# EAGLE design Grove - Temperature, Humidity, Pressure and Gas Sensor (BME680) (EAGLE 6.4)
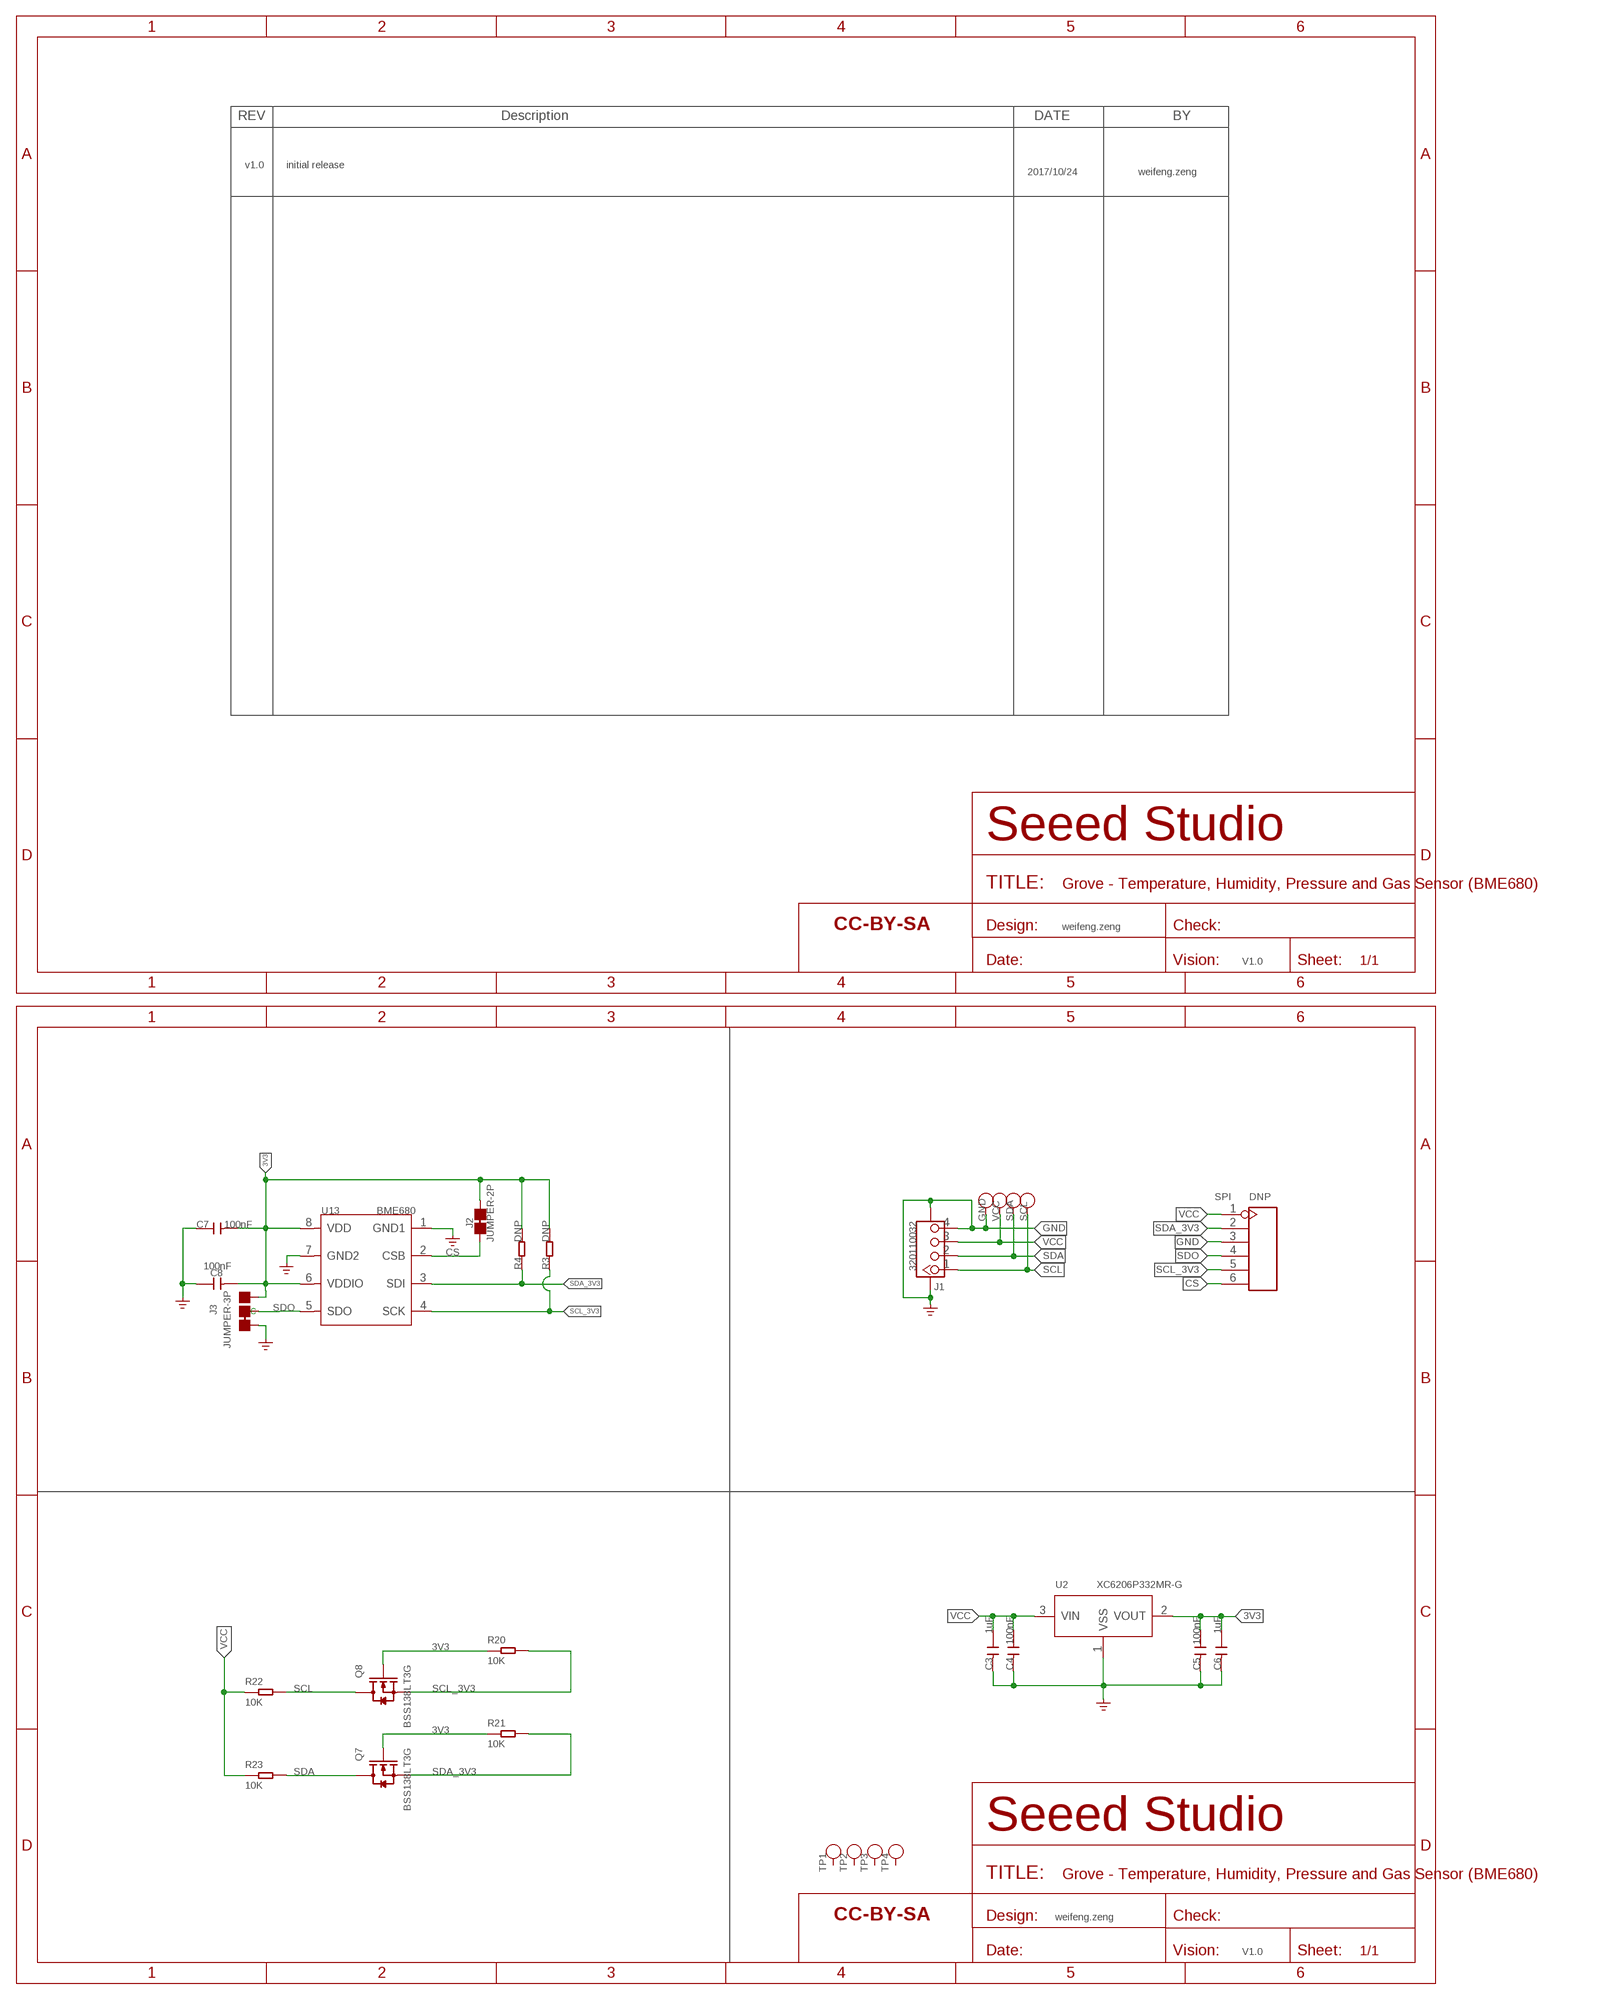
[diagram p0: schematic, sheet 1]

## Parts
C3  1uF  CAP-0603  [C0603]
C4  100nF  CAP-0603  [C0603]
C5  100nF  CAP-0603  [C0603]
C6  1uF  CAP-0603  [C0603]
C7  100nF  CAP-0603  [C0603]
C8  100nF  CAP-0603  [C0603]
FR1  SEEEDSTUDIO-OPEN-SCH-FRAME  [SEEEDSTUDIO-PCB-FRAME]
FR2  SEEEDSTUDIO-OPEN-SCH-FRAME  [SEEEDSTUDIO-PCB-FRAME]
GND  TEST-POINT'4545'  [TP-D45MIL]
J1  320110032  GROVE-CONNECTOR-SMD'90D'  [HW4-SMD-2.0-90D]
J2  JUMPER-2P  JUMPER-2P-SHORT  [2P-SMD-SHORT]
J3  JUMPER-3P  JUMPER-3P-SHORT  [3P-SMD-SHORT]
Q7  BSS138LT3G  MOSFET-N'SOT23'  [SOT-23]
Q8  BSS138LT3G  MOSFET-N'SOT23'  [SOT-23]
R3  DNP  RES-0603  [R0603]
R4  DNP  RES-0603  [R0603]
R20  10K  RES-0603  [R0603]
R21  10K  RES-0603  [R0603]
R22  10K  RES-0603  [R0603]
R23  10K  RES-0603  [R0603]
SCL  TEST-POINT'4545'  [TP-D45MIL]
SDA  TEST-POINT'4545'  [TP-D45MIL]
SPI  DNP  HEADER-6P-65/35MIL  [H6-2.54-C65D35MIL]
TP1  TEST-POINT'4545'  [TP-D45MIL]
TP2  TEST-POINT'4545'  [TP-D45MIL]
TP3  TEST-POINT'4545'  [TP-D45MIL]
TP4  TEST-POINT'4545'  [TP-D45MIL]
U2  XC6206P332MR-G  PMIC-XC6206PMR  [SOT-23]
U13  BME680  SENSOR-BME680  [SNR8-0.8-3X3X0.93MM]
VCC  TEST-POINT'4545'  [TP-D45MIL]

## Nets
3V3: C5.1 C6.1 C7.2 C8.2 J2.2 J3.00(R) Q7.1(G) Q8.1(G) R3.2 R4.2 R20.1 R21.1 U2.2(VOUT) U13.6(VDDIO) U13.8(VDD)
CS: J2.1 SPI.6 U13.2(CSB)
GND: C3.2 C4.2 C5.2 C6.2 C7.1 C8.1 GND.T J1.4 J1.SS1 J1.SS2 J3.11(L) SPI.3 U2.1(VSS) U13.1(GND1) U13.7(GND2) ; supply symbol labelled GND_POWER
SCL: J1.1 Q8.3(D) R22.2 SCL.T
SCL_3V3: Q8.2(S) R3.1 R20.2 SPI.5 U13.4(SCK)
SDA: J1.2 Q7.3(D) R23.2 SDA.T
SDA_3V3: Q7.2(S) R4.1 R21.2 SPI.2 U13.3(SDI)
SDO: J3.MM(C) SPI.4 U13.5(SDO)
VCC: C3.1 C4.1 J1.3 R22.1 R23.1 SPI.1 U2.3(VIN) VCC.T
Unconnected: TP1.T TP2.T TP3.T TP4.T

## Notes on the sheet
- v1.0 | initial release
- 2017/10/24 | weifeng.zeng
- weifeng.zeng
- V1.0
- weifeng.zeng
- V1.0

## Library data of the parts
C3-C8 = Discrete-new:CAP: Ceramic Capacitors
FR1 FR2 = moudle-new:SEEEDSTUDIO-OPEN-SCH-FRAME
GND SCL SDA TP1-TP4 VCC = Discrete-new:TEST-POINT; PARTNO: DNP
J1 = Connector-new:GROVE-CONNECTOR-SMD: 4P-SMD-2.0:320110030;4P-SMD-2.0-90D:320110032
J2 = Discrete-new:JUMPER-2P-SHORT
J3 = Discrete-new:JUMPER-3P-SHORT
Q7 Q8 = Discrete-new:MOSFET-N
R3 R4 R20-R23 = Discrete-new:RES
SPI = Connector-new:HEADER-6P
U2 = IC-new:PMIC-XC6206P: LOW ESR Cap.Compatible Positive Voltage Regulators
U13 = Discrete-new:SENSOR-BME680

## Board
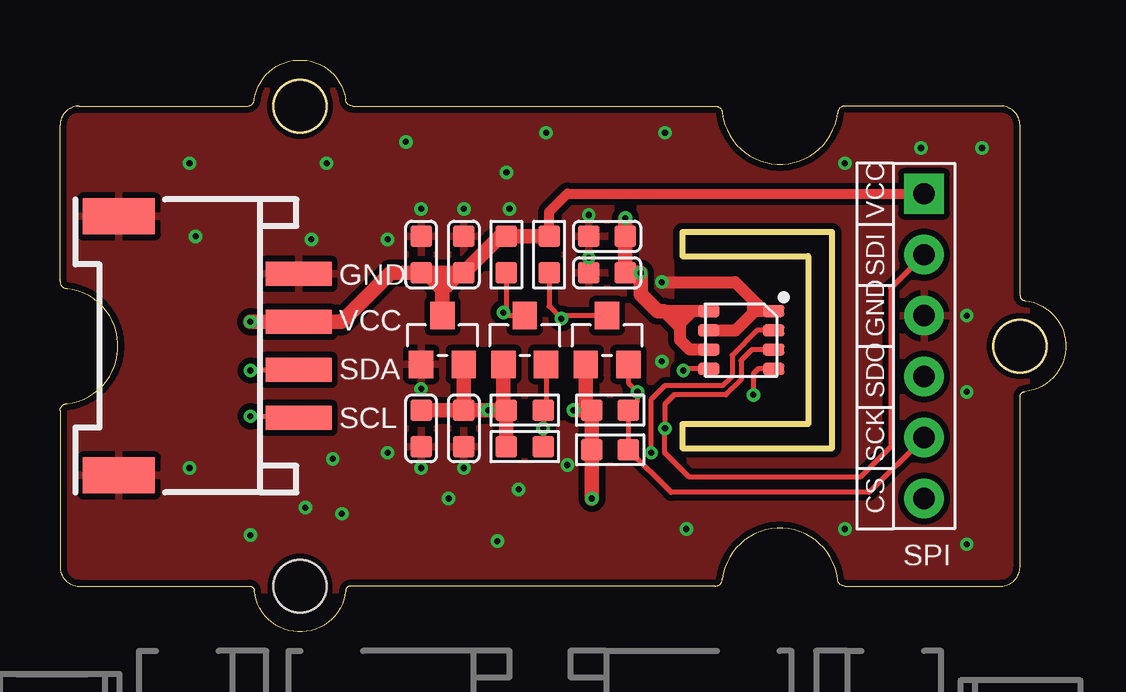
[diagram p1: board, top side]
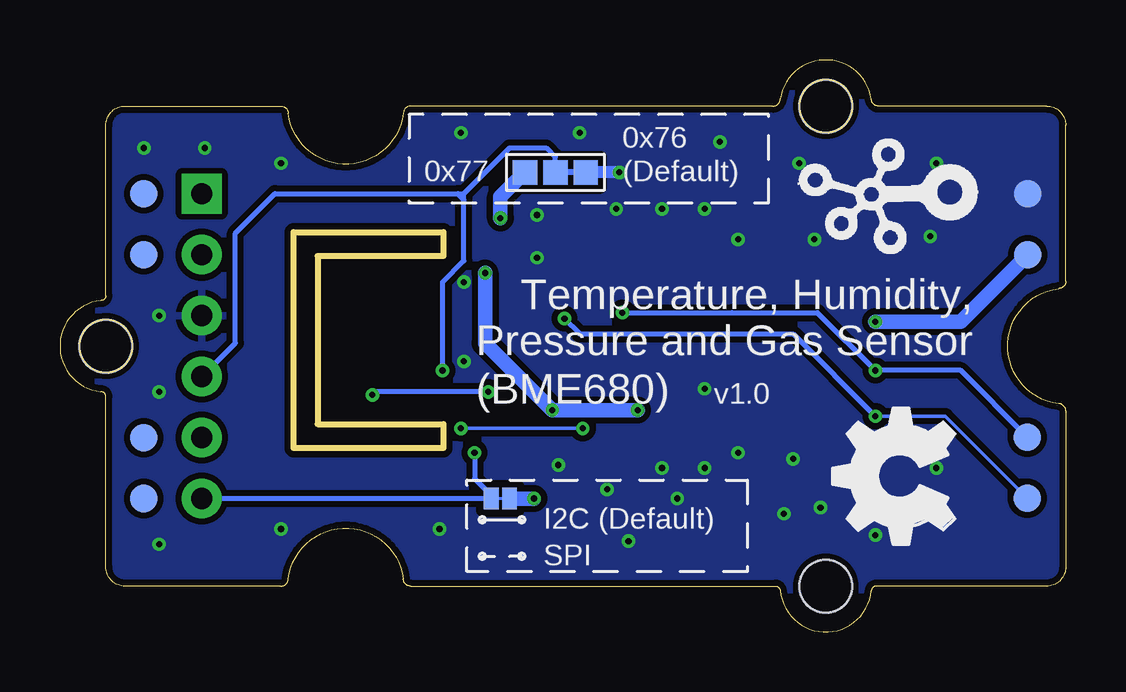
[diagram p2: board, bottom side, seen from below]

Size 41.91 x 23.83 mm. Coordinates in mm from the lower left corner, seen from the top.
Outline: 25.94,15.66 31.17,15.66 31.17,8.66 25.94,8.66 25.94,7.66 32.17,7.66 32.17,16.66 25.94,16.66 25.94,15.66
Copper layers (1*16): Top 0.035mm / dielectric 1.5mm / Bottom 0.035mm
Design rules "SeeedStudio_2layer_DRU_no_angle_20140221 *": minimum track width 6mil, minimum drill 10mil, track to track 6mil, track to pad 6mil, pad to pad 6mil, via to via 6mil, smd to smd 0mil, copper to edge 10mil, drill to drill 10mil, minimum pad ring 10mil, minimum via ring 6mil, stop-mask expansion 2mil, vias tented up to drill 25mil, thermal gap 10mil
tRestrict: area 25.8,7.6 to 32.2,16.7
bRestrict: area 25.8,7.6 to 32.2,16.7

### Footprints (pad centres in the part's own frame; a part is rotated, then mirrored left to right if it is on the bottom)
C0603 = smd 0.889 x 0.889: 1 0,0.762; 2 0,-0.762
TP-D45MIL = smd 1.143 x 1.143: T 0,0
HW4-SMD-2.0-90D = smd 1.01 x 2.74: 1 -3,-0.1; 2 -1,-0.1; 3 1,-0.1; 4 3,-0.1 | smd 1.5 x 3: SS1 -5.4,7.4; SS2 5.4,7.4
2P-SMD-SHORT = smd 0.889 x 0.61: 1 0,0.381; 2 0,-0.381
3P-SMD-SHORT = smd 1.016 x 1.016: 00 -1.27,0; 11 1.27,0; MM 0,0
SOT-23 = smd 1.143 x 1.016: 1 1.016,-0.889; 2 1.016,0.889; 3 -1.016,0
R0603 = smd 0.889 x 0.889: 1 0,0.762; 2 0,-0.762
H6-2.54-C65D35MIL = drill 0.889 pad 1.651 square: 1 0,6.35 | drill 0.889 pad 1.651: 2 0,3.81; 3 0,1.27; 4 0,-1.27; 5 0,-3.81; 6 0,-6.35
SOT-23' = smd 1.016 x 1.143: 1 -0.889,-1.016; 2 0.889,-1.016; 3 0,1.016
GROVE-TEST-PLATFORM = hole 2.2: -10,-10; -10,10; 20,0
SNR8-0.8-3X3X0.93MM = smd 0.9 x 0.5: 1 1.35,1.2; 2 1.35,0.4; 3 1.35,-0.4; 4 1.35,-1.2; 5 -1.35,-1.2; 6 -1.35,-0.4; 7 -1.35,0.4; 8 -1.35,1.2

### Placement (x,y rotation side)
C3  15.05,15.72 180 top
C4  16.83,15.72 180 top
C5  15.05,8.48 0 top
C6  16.83,8.48 0 top
C7  22.79,16.48 90 top
C8  22.79,14.96 90 top
FR1  -3.75,-9.05 0 top  (outside the outline)
FR2  -4.51,-19.46 0 top  (outside the outline)
GND  1.59,18.26 90 bottom
J1  9.85,11.92 90 top
J2  23.56,5.56 90 bottom
J3  21.27,19.15 0 bottom
Q7  19.37,12.16 270 top
Q8  22.79,12.16 270 top
R3  22.92,7.59 270 top
R4  19.37,7.72 270 top
R20  22.92,9.24 90 top
R21  19.37,9.24 90 top
R22  20.38,15.72 0 top
R23  18.6,15.72 0 top
SCL  1.6,5.56 90 bottom
SDA  1.6,8.11 90 bottom
SPI  36,11.91 0 top
TP1  38.42,18.26 0 bottom
TP2  38.42,15.72 0 bottom
TP3  38.42,8.1 0 bottom
TP4  38.42,5.56 0 bottom
U2  XC6206P332MR-G  [SOT-23']  15.94,12.16 0 top
U10  [GROVE-TEST-PLATFORM]  20,11.91 0 top
U13  28.38,12.16 0 top
U$3  [OSHW_FILLX200_NOTEXT]  4.63,3.65 90 bottom
U$4  [TWIGLOGO]  4.63,18.26 90 bottom
VCC  1.59,15.72 90 bottom

### Tracks (layer width: path | path; a pad name or v marks a point on that pad's centre or on a via)
3V3  (via drill 0.25 pad 0.51)
  Top 0.508: U13.8 26.35,13.36 | 26.35,13.36 25.84,13.36 | 25.84,13.36 25.15,13.36 25.84,12.67 | U13.6 26.24,11.76 25.84,12.16 25.84,12.67 | 25.84,13.36 25.84,13.31 | 25.84,12.8 25.84,12.92 25.84,13.31 | 25.84,12.67 25.84,12.85 26.35,13.36 | 25.84,13.31 26.22,13.31
  Top 0.61: v23.56,17.24 C7.2 C8.2 v24.19,14.96 24.19,14.07 24.9,13.36 25.15,13.36 | U2.2 C6.1 | C5.1 C6.1 | R4.2 R21.1 | 25.46,13.31 25.84,12.92 | R20.1 R3.2 v22.16,5.56 | R21.1 v17.84,9.24 C6.1 | Q7.1 18.48,9.37 R21.1 | Q8.1 21.91,9.5 R20.1 | R20.1 v21.4,9.24
  Bottom 0.61: v23.56,17.24 23.56,18.13 J3.00 | v22.16,5.56 J2.2 | v17.84,9.24 v21.4,9.24 24.19,12.04 v24.19,14.96
CS  (via drill 0.25 pad 0.51)
  Top 0.203: U13.2 29.03,12.56 28,11.53 28,10.64 27.62,10.26 25.21,10.26 24.64,9.69 v24.64,7.46
  Bottom 0.203: v24.64,7.46 24.64,6.38 23.94,5.69 J2.1 SPI.6
GND  (via drill 0.25 pad 0.51)
  Top 0.508: U13.7 28.15,12.56 28.89,13.31 | U13.1 28.95,13.36 28.89,13.31 | 28.89,13.31 28.89,13.81 | 28.89,13.81 28.13,14.58 v25.08,14.58 | 28.89,13.81 29.27,13.43
  Bottom 0.508: v18.6,19.15 J3.11
  other vias: 22.03,15.59 15.05,6.83 16.83,6.83 19.11,5.94 21.14,6.96 25.08,11.27 13.65,7.46 11.36,7.21 15.05,10.13 22.03,17.37 18.73,17.62 16.83,17.62 15.05,17.62 13.65,16.35 5.4,6.83 5.65,16.48 5.4,19.53 10.48,16.35 11.11,19.53 14.41,20.42 20.25,20.8 25.21,20.8 32.7,19.53 10.22,5.18 7.94,4.03 11.75,4.92 16.19,5.56 18.22,3.78 26.1,4.29 32.7,4.29 37.78,13.18 37.78,10 37.78,3.65 38.42,20.16 35.88,20.16
  pour Top (isolate 0.254): -0.32,22.7 40.32,22.7 40.32,1.75 -0.32,1.75
  pour Bottom (isolate 0.254): -0.32,22.7 40.32,22.7 40.32,1.75 -0.32,1.75
SCL  (via drill 0.25 pad 0.51)
  Top 0.203: Q8.3 21.02,13.18 v20.89,13.05 20.38,13.56 R22.2 | v7.94,8.99 9.88,8.99 J1.1
  Bottom 0.152: SCL.T 5.02,8.99 v7.94,8.99
  Bottom 0.203: v7.94,8.99 11.36,12.42 20.25,12.42 v20.89,13.05
SCL_3V3  (via drill 0.25 pad 0.51)
  Top 0.203: SPI.5 33.72,5.81 25.46,5.81 R3.1 R20.2 24.06,9.62 v24.06,10 23.68,10.38 Q8.2 | U13.4 29.09,10.96 28.89,10.77 v28.89,9.88
  Bottom 0.203: v24.06,10 28.76,10 v28.89,9.88
SDA  (via drill 0.25 pad 0.51)
  Top 0.203: Q7.3 18.6,13.18 v18.48,13.31 18.6,13.43 R23.2 | v7.94,10.89 7.96,10.92 J1.2
  Bottom 0.203: v18.48,13.31 13.9,13.31 10.35,13.31 v7.94,10.89 4.38,10.89 SDA.T
SDA_3V3  (via drill 0.25 pad 0.51)
  Top 0.152: v20.13,8.48 20.13,8.35
  Top 0.203: Q7.2 20.25,9.37 R21.2 20.13,8.35 R4.1 | SPI.2 34.61,14.32 34.61,7.72 33.34,6.45 26.22,6.45 25.21,7.46 v25.21,8.48 25.21,9.5 25.59,9.88 27.75,9.88 28.38,10.51 28.38,11.31 28.83,11.76 U13.3
  Bottom 0.152: v25.21,8.48 v20.13,8.48
SDO  (via drill 0.25 pad 0.51)
  Top 0.203: U13.5 26.04,10.96 v25.97,10.89
  Bottom 0.203: v25.97,10.89 25.97,14.58 25.08,15.46 25.08,18 | SPI.4 34.61,12.04 34.61,16.61 32.95,18.26 25.33,18.26 | 25.33,18.26 25.08,18.26 | 25.08,18.26 23.18,20.16 21.65,20.16 21.27,19.78 J3.MM | 25.08,18 25.08,18.26 | 25.08,18 25.33,18.26
VCC  (via drill 0.25 pad 0.51)
  Top 0.406: R22.1 20.38,17.5 21.14,18.26 SPI.1
  Top 0.508: C3.1 15.17,14.96 15.94,14.19 16.06,14.32 16.7,14.96 C4.1
  Top 0.61: v7.94,12.92 J1.3 11.74,12.92 13.78,14.96 C3.1 16.06,14.96 | 16.06,14.96 C4.1 18.35,16.48 R23.1 R22.1 | U2.3 15.94,14.19 15.94,14.83 16.06,14.96
  Bottom 0.61: VCC.T 4.38,12.92 v7.94,12.92

### Text on the board
tPlace: VCC | GND | SDI | VCC | GND | SDA | SDO | SCL | SCK | CS
bPlace: 0x76 | (Default) | 0x77 | Temperature, Humidity, / Pressure and Gas Sensor | v1.0 | (BME680) | (Default) | I2C | SPI